# EAGLE design 2x8 To 1x16 (EAGLE 6.4)
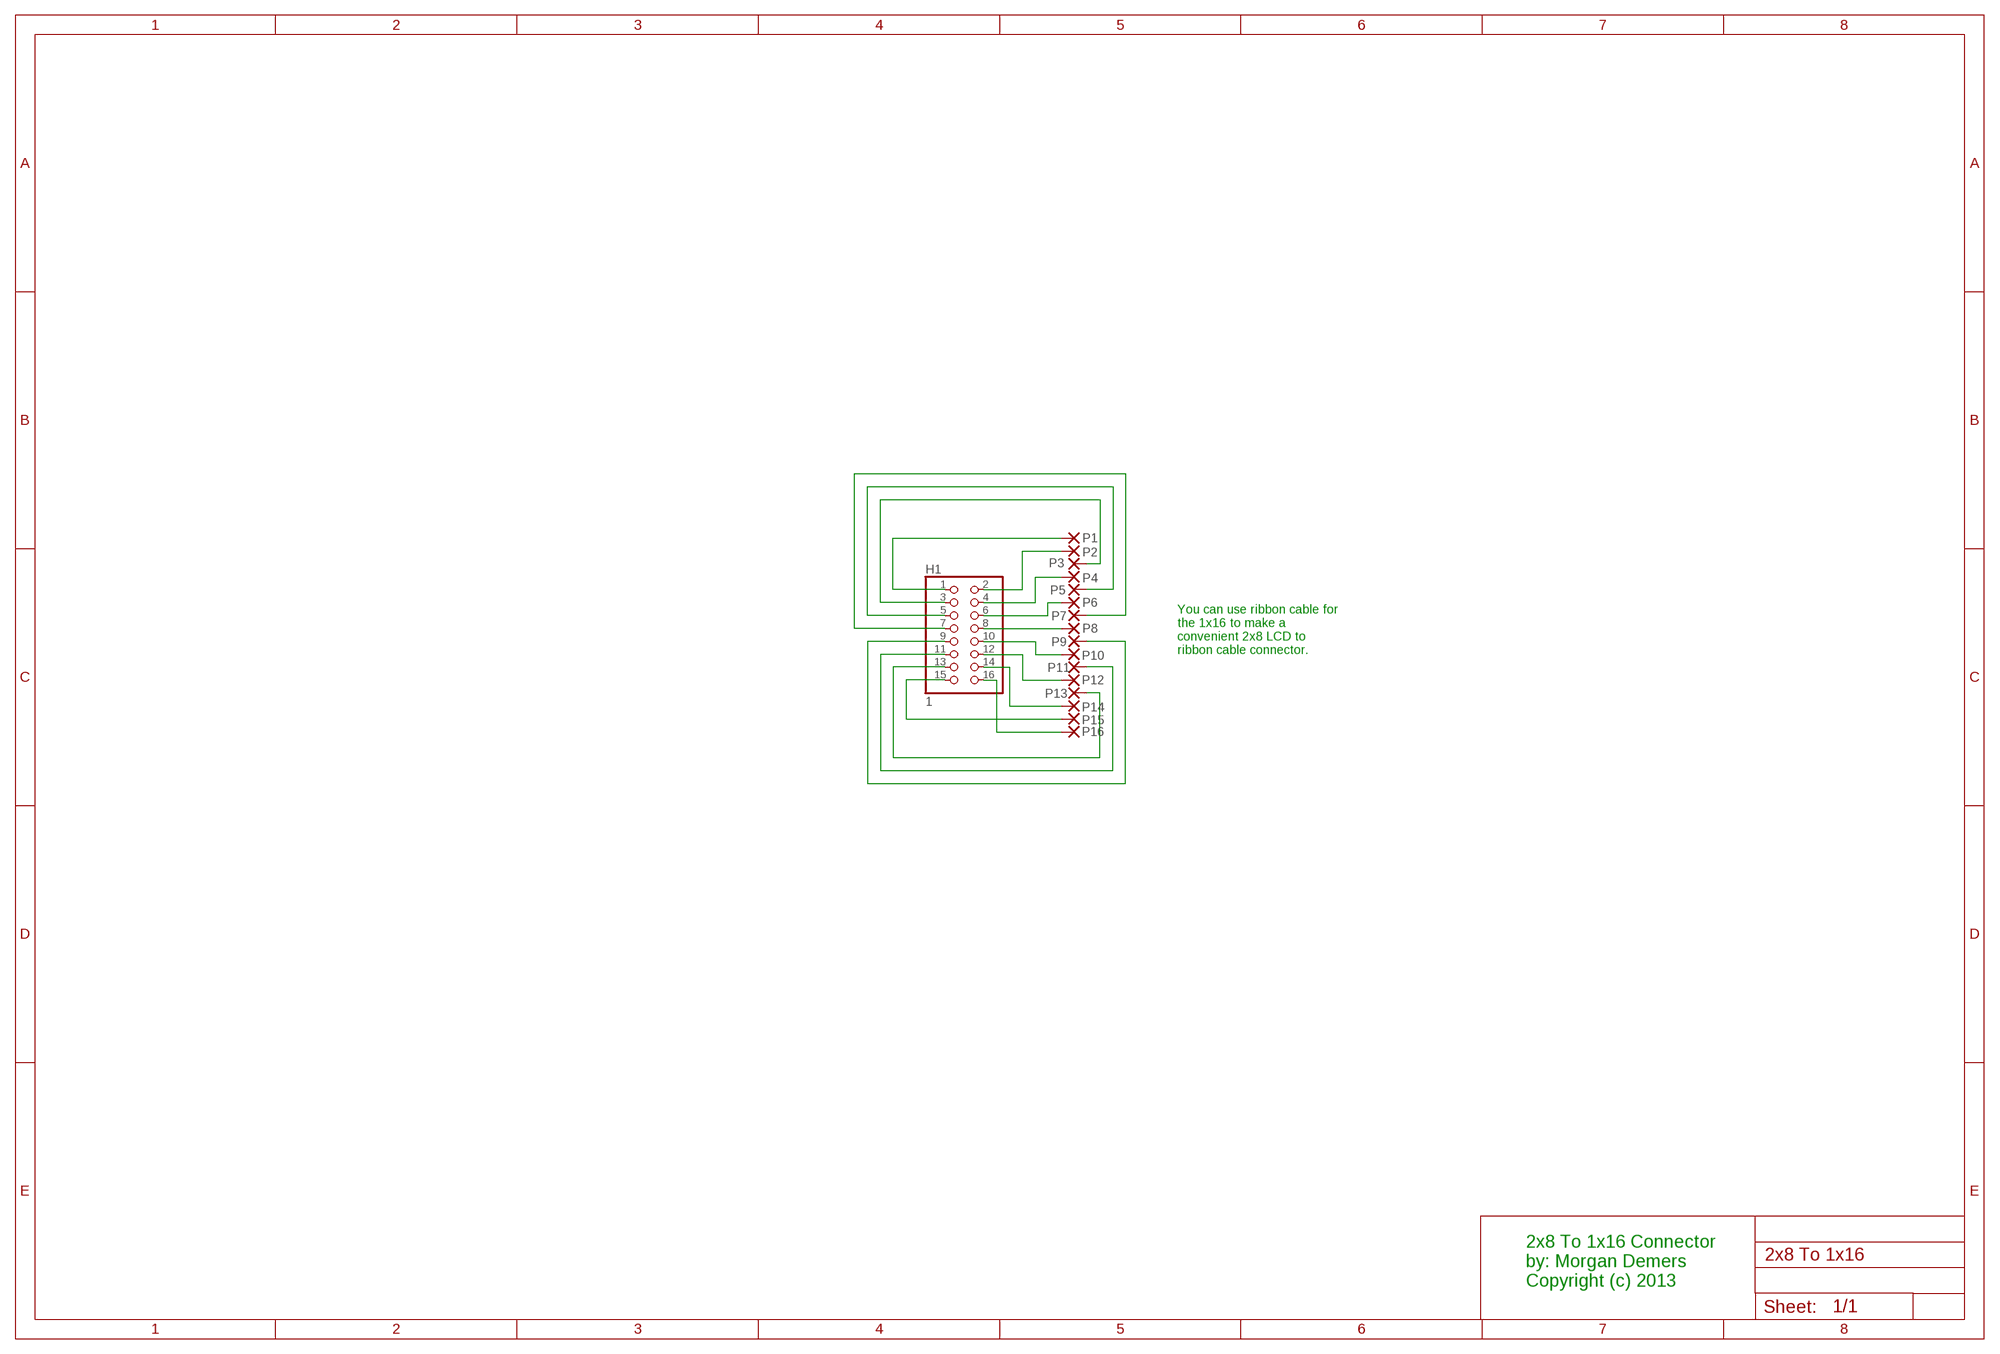
[diagram p0: schematic, sheet 1]

## Parts
H1  1  PINHD-2X8  [2X08]
P1  1,6/0,9  [1,6/0,9]
P2  1,6/0,9  [1,6/0,9]
P3  1,6/0,9  [1,6/0,9]
P4  1,6/0,9  [1,6/0,9]
P5  1,6/0,9  [1,6/0,9]
P6  1,6/0,9  [1,6/0,9]
P7  1,6/0,9  [1,6/0,9]
P8  1,6/0,9  [1,6/0,9]
P9  1,6/0,9  [1,6/0,9]
P10  1,6/0,9  [1,6/0,9]
P11  1,6/0,9  [1,6/0,9]
P12  1,6/0,9  [1,6/0,9]
P13  1,6/0,9  [1,6/0,9]
P14  1,6/0,9  [1,6/0,9]
P15  1,6/0,9  [1,6/0,9]
P16  1,6/0,9  [1,6/0,9]

## Nets
S$1: H1.1 P1.1(P)
S$3: H1.3 P3.1(P)
S$4: H1.2 P2.1(P)
S$5: H1.5 P5.1(P)
S$6: H1.6 P6.1(P)
S$7: H1.7 P7.1(P)
S$9: H1.9 P9.1(P)
S$11: H1.11 P11.1(P)
S$13: H1.13 P13.1(P)
S$15: H1.15 P15.1(P)
S$18: H1.4 P4.1(P)
S$20: H1.8 P8.1(P)
S$21: H1.12 P12.1(P)
S$22: H1.10 P10.1(P)
S$23: H1.14 P14.1(P)
S$24: H1.16 P16.1(P)

## Notes on the sheet
- You can use ribbon cable for
  the 1x16 to make a
  convenient 2x8 LCD to
  ribbon cable connector.
- 2x8 To 1x16 Connector
  by: Morgan Demers
  Copyright (c) 2013

## Library data of the parts
H1 = pinhead:PINHD-2X8: PIN HEADER
P1-P16 = wirepad:1,6/0,9: THROUGH-HOLE PAD

## Board
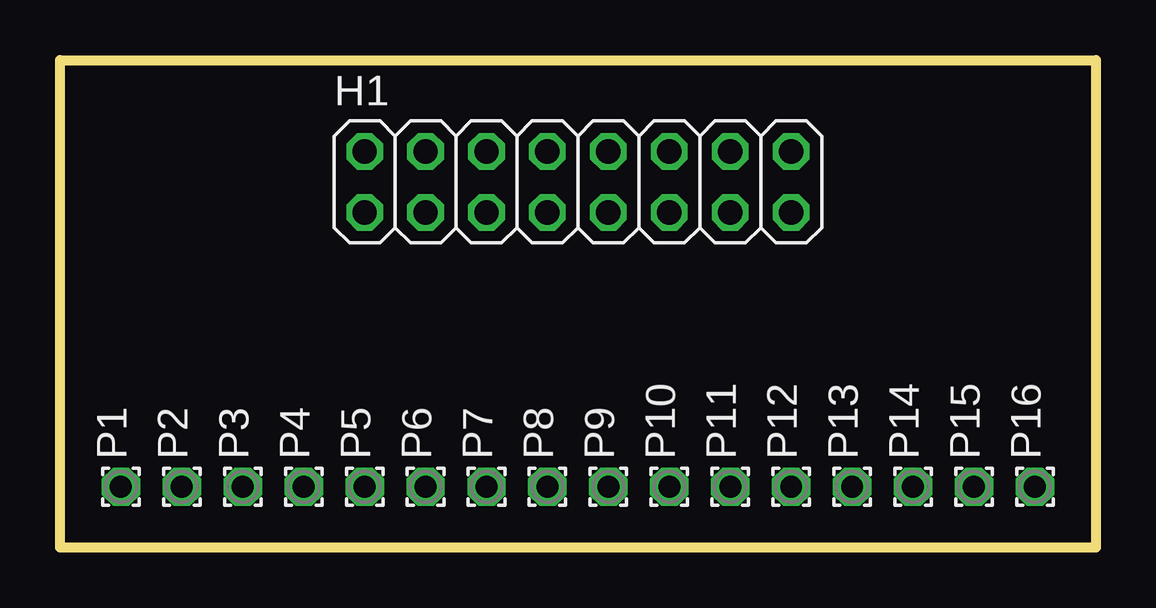
[diagram p1: board, top side]
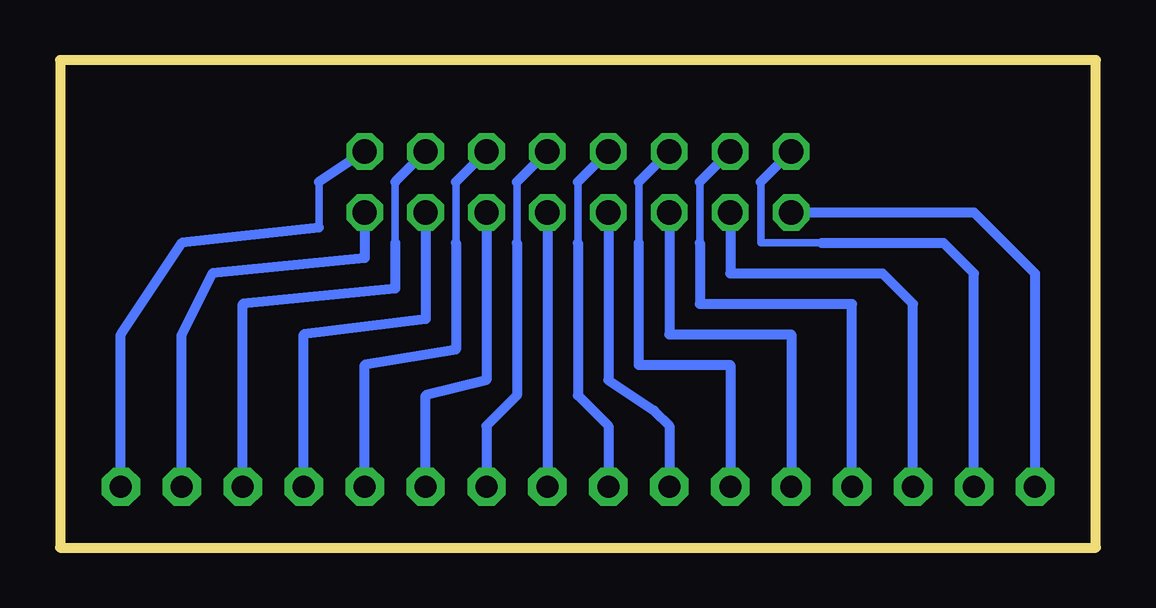
[diagram p2: board, bottom side, seen from below]

Size 43.18 x 20.32 mm. Coordinates in mm from the lower left corner, seen from the top.
Outline: 0,0 0,20.32 43.18,20.32 43.18,0 0,0
Copper layers (1*16): Top 0.035mm / dielectric 1.5mm / Bottom 0.035mm
Design rules "default": minimum track width 10mil, minimum drill 24mil, track to track 8mil, track to pad 8mil, pad to pad 8mil, via to via 8mil, smd to smd 8mil, copper to edge 40mil, drill to drill 8mil, minimum pad ring 10mil, minimum via ring 8mil, stop-mask expansion 4mil, vias tented up to drill 0mil, thermal gap 10mil

### Footprints (pad centres in the part's own frame; a part is rotated, then mirrored left to right if it is on the bottom)
2X08 = drill 1.016 octagon: 1 -8.89,-1.27; 2 -8.89,1.27; 3 -6.35,-1.27; 4 -6.35,1.27; 5 -3.81,-1.27; 6 -3.81,1.27; 7 -1.27,-1.27; 8 -1.27,1.27; 9 1.27,-1.27; 10 1.27,1.27; 11 3.81,-1.27; 12 3.81,1.27; 13 6.35,-1.27; 14 6.35,1.27; 15 8.89,-1.27; 16 8.89,1.27
1,6/0,9 = drill 0.914 pad 1.6 octagon: 1 0,0

### Placement (x,y rotation side)
H1  21.59,15.24 0 top
P1  2.54,2.54 0 top
P2  5.08,2.54 0 top
P3  7.62,2.54 0 top
P4  10.16,2.54 0 top
P5  12.7,2.54 0 top
P6  15.24,2.54 0 top
P7  17.78,2.54 0 top
P8  20.32,2.54 0 top
P9  22.86,2.54 0 top
P10  25.4,2.54 0 top
P11  27.94,2.54 0 top
P12  30.48,2.54 0 top
P13  33.02,2.54 0 top
P14  35.56,2.54 0 top
P15  38.1,2.54 0 top
P16  40.64,2.54 0 top

### Tracks (layer width: path | path; a pad name or v marks a point on that pad's centre or on a via)
S$1
  Bottom 0.406: H1.1 5.08,13.97 2.54,11.43 P1.1
S$3
  Bottom 0.406: H1.3 15.24,11.43 8.89,11.43 7.62,10.16 P3.1
S$4
  Bottom 0.305: 13.97,15.24 13.97,12.7 11.43,12.7
  Bottom 0.406: H1.2 13.97,15.24 | 11.43,12.7 6.35,12.7 5.08,11.43 P2.1
S$5
  Bottom 0.406: H1.5 17.78,8.89 12.7,8.89 P5.1
S$6
  Bottom 0.305: 19.05,12.7 19.05,15.24
  Bottom 0.406: H1.6 19.05,15.24 | 19.05,12.7 19.05,7.62 15.24,7.62 P6.1
S$7
  Bottom 0.406: H1.7 20.32,6.98 18.41,5.72 17.78,5.08 P7.1
S$9
  Bottom 0.406: H1.9 P9.1
S$11
  Bottom 0.406: H1.11 25.4,6.98 27.94,6.35 P11.1
S$13
  Bottom 0.406: H1.13 27.94,9.53 33.02,8.89 P13.1
S$15
  Bottom 0.406: H1.15 30.48,12.07 36.83,11.43 38.1,8.89 P15.1
S$18
  Bottom 0.305: 16.51,12.7 16.51,15.24
  Bottom 0.406: H1.4 16.51,15.24 | 16.51,12.7 16.51,10.16 10.16,10.16 P4.1
S$20
  Bottom 0.305: 21.59,15.24 21.59,12.7
  Bottom 0.406: H1.8 21.59,15.24 | 21.59,12.7 21.59,6.35 20.32,5.08 P8.1
S$21
  Bottom 0.305: 26.67,15.24 26.67,12.7
  Bottom 0.406: H1.12 26.67,15.24 | 26.67,12.7 26.67,8.26 30.48,7.62 P12.1
S$22
  Bottom 0.305: 24.13,15.24 24.13,12.7
  Bottom 0.406: H1.10 24.13,15.24 | 24.13,12.7 24.13,6.35 25.4,5.08 P10.1
S$23
  Bottom 0.305: 29.21,15.24 29.21,12.7
  Bottom 0.406: H1.14 29.21,15.24 | 29.21,12.7 29.21,10.8 35.56,10.16 P14.1
S$24
  Bottom 0.305: 32.39,15.24 32.39,13.34
  Bottom 0.406: H1.16 32.39,15.24 | 32.39,13.34 38.1,12.7 40.64,8.89 P16.1

### Text on the board
tDocu: 16 | 2x8 LCD | by | to 1x16 | Morgan | v1a | Demers | 15 | 16